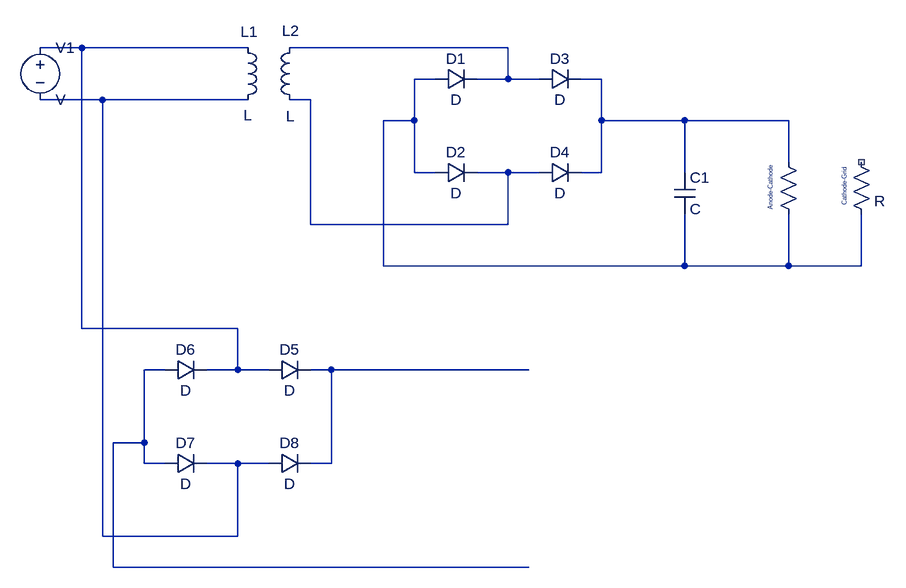
[diagram p0: schematic main_circuit.asc]
main_circuit.asc, the LTspice schematic file:
Version 4
SHEET 1 1364 980
WIRE -16 176 -80 176
WIRE 240 176 -16 176
WIRE 640 176 304 176
WIRE 528 224 496 224
WIRE 640 224 640 176
WIRE 640 224 592 224
WIRE 688 224 640 224
WIRE 784 224 752 224
WIRE 16 256 -80 256
WIRE 240 256 16 256
WIRE 336 256 304 256
WIRE 496 288 496 224
WIRE 496 288 448 288
WIRE 784 288 784 224
WIRE 912 288 784 288
WIRE 1072 288 912 288
WIRE 1072 352 1072 288
WIRE 496 368 496 288
WIRE 528 368 496 368
WIRE 640 368 592 368
WIRE 688 368 640 368
WIRE 784 368 784 288
WIRE 784 368 752 368
WIRE 912 368 912 288
WIRE 336 448 336 256
WIRE 640 448 640 368
WIRE 640 448 336 448
WIRE 448 512 448 288
WIRE 912 512 912 432
WIRE 912 512 448 512
WIRE 1072 512 1072 432
WIRE 1072 512 912 512
WIRE 1184 512 1184 432
WIRE 1184 512 1072 512
WIRE -16 608 -16 176
WIRE 224 608 -16 608
WIRE 112 672 80 672
WIRE 224 672 224 608
WIRE 224 672 176 672
WIRE 272 672 224 672
WIRE 368 672 336 672
WIRE 672 672 368 672
WIRE 80 784 80 672
WIRE 80 784 32 784
WIRE 80 816 80 784
WIRE 112 816 80 816
WIRE 224 816 176 816
WIRE 272 816 224 816
WIRE 368 816 368 672
WIRE 368 816 336 816
WIRE 16 928 16 256
WIRE 224 928 224 816
WIRE 224 928 16 928
WIRE 32 976 32 784
WIRE 672 976 32 976
SYMBOL voltage -80 160 R0
SYMATTR InstName V1
SYMBOL ind 224 160 R0
WINDOW 0 4 -9 Left 2
WINDOW 3 9 120 Left 2
SYMATTR InstName L1
SYMBOL ind 320 272 R180
WINDOW 0 1 122 Left 2
WINDOW 3 8 -9 Left 2
SYMATTR InstName L2
SYMBOL cap 896 368 R0
SYMATTR InstName C1
SYMBOL diode 528 240 R270
WINDOW 0 32 32 VTop 2
WINDOW 3 0 32 VBottom 2
SYMATTR InstName D1
SYMBOL diode 528 384 R270
WINDOW 0 32 32 VTop 2
WINDOW 3 0 32 VBottom 2
SYMATTR InstName D2
SYMBOL diode 688 240 R270
WINDOW 0 32 32 VTop 2
WINDOW 3 0 32 VBottom 2
SYMATTR InstName D3
SYMBOL diode 688 384 R270
WINDOW 0 32 32 VTop 2
WINDOW 3 0 32 VBottom 2
SYMATTR InstName D4
SYMBOL res 1056 336 R0
WINDOW 0 -12 19 VRight 0
SYMATTR InstName Anode-Cathode
SYMATTR Value ""
SYMBOL res 1168 336 R0
WINDOW 0 -10 22 VRight 0
SYMATTR InstName Cathode-Grid
SYMBOL diode 272 688 R270
WINDOW 0 32 32 VTop 2
WINDOW 3 0 32 VBottom 2
SYMATTR InstName D5
SYMBOL diode 112 688 R270
WINDOW 0 32 32 VTop 2
WINDOW 3 0 32 VBottom 2
SYMATTR InstName D6
SYMBOL diode 112 832 R270
WINDOW 0 32 32 VTop 2
WINDOW 3 0 32 VBottom 2
SYMATTR InstName D7
SYMBOL diode 272 832 R270
WINDOW 0 32 32 VTop 2
WINDOW 3 0 32 VBottom 2
SYMATTR InstName D8

The netlist it stands for:
* main_circuit.asc
V1 N001 N005 V
L1 N001 N005 L
L2 N006 N002 L
C1 N004 N003 C
D1 N003 N002 D
D2 N003 N006 D
D3 N002 N004 D
D4 N006 N004 D
R§Anode-Cathode N004 N003
R§Cathode-Grid NC_01 N003 R
D5 N001 N008 D
D6 N007 N001 D
D7 N007 N005 D
D8 N005 N008 D
.model D D
.lib standard.dio
.backanno
.end